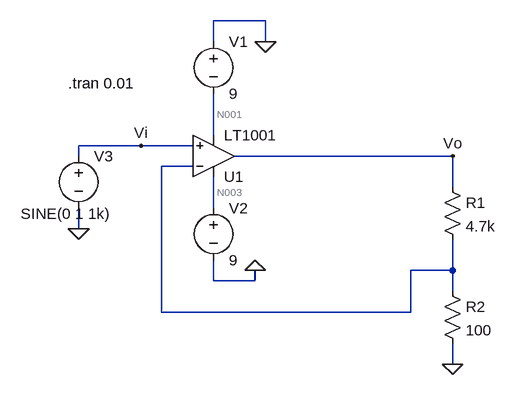
[diagram p0: schematic Op-Amp feedback (VCCS).asc]
Op-Amp feedback (VCCS).asc, the LTspice schematic file:
Version 4
SHEET 1 880 680
WIRE 304 -144 224 -144
WIRE 224 -112 224 -144
WIRE 304 -112 304 -144
WIRE 224 32 224 -32
WIRE 112 48 16 48
WIRE 192 48 112 48
WIRE 16 64 16 48
WIRE 592 64 256 64
WIRE 192 80 144 80
WIRE 592 112 592 64
WIRE 224 144 224 96
WIRE 16 176 16 144
WIRE 592 240 592 192
WIRE 592 240 528 240
WIRE 224 256 224 224
WIRE 288 256 288 240
WIRE 288 256 224 256
WIRE 592 272 592 240
WIRE 144 304 144 80
WIRE 528 304 528 240
WIRE 528 304 144 304
WIRE 592 384 592 352
FLAG 288 240 0
FLAG 304 -112 0
FLAG 16 176 0
FLAG 592 384 0
FLAG 592 64 Vo
FLAG 112 48 Vi
SYMBOL OpAmps\\LT1001 224 128 M180
SYMATTR InstName U1
SYMBOL voltage 224 -128 R0
SYMATTR InstName V1
SYMATTR Value 9
SYMBOL voltage 224 128 R0
SYMATTR InstName V2
SYMATTR Value 9
SYMBOL res 576 96 R0
SYMATTR InstName R1
SYMATTR Value 4.7k
SYMBOL res 576 256 R0
SYMATTR InstName R2
SYMATTR Value 100
SYMBOL voltage 16 48 R0
WINDOW 3 -89 105 Left 2
WINDOW 123 0 0 Left 0
WINDOW 39 0 0 Left 0
SYMATTR Value SINE(0 1 1k)
SYMATTR InstName V3
TEXT 0 -48 Left 2 !.tran 0.01

The netlist it stands for:
* Op-Amp feedback (VCCS).asc
XU1 Vi N002 N003 N001 Vo LT1001  ; pins In+ In- V+ V- OUT
V1 0 N001 9
V2 N003 0 9
R1 Vo N002 4.7k
R2 N002 0 100
V3 Vi 0 SINE(0 1 1k)
.tran 0.01
.lib LTC.lib
.backanno
.end

* Results of the author's LTspice run, read from the files saved beside the schematic
* Operating Point, zero values left out:
*   V(n003) = 9 V
*   V(n001) = -9 V
*   I(V2) = -2.25 mA
*   I(V1) = -2.25 mA
*   Ix(u1:3) = 2.25 mA
*   Ix(u1:4) = -2.25 mA
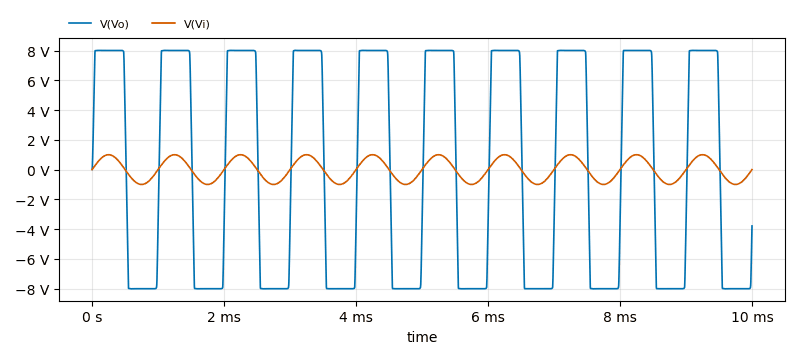
[diagram p1: Transient Analysis of Op-Amp feedback (VCCS).asc, plotted from the saved traces]
* Transient Analysis, 1 run:
*   V(Vo): min -8.017 V, max 8.019 V, average 7.812 mV, rms 7.644 V, last -3.789 V
*   V(Vi): min -1 V, max 1 V, average 45.91 µV, rms 707.2 mV, last 0 V